# Altium schematic sheet Sheet1.SchDoc
size A4; SheetNumber: 1; SheetTotal: 1
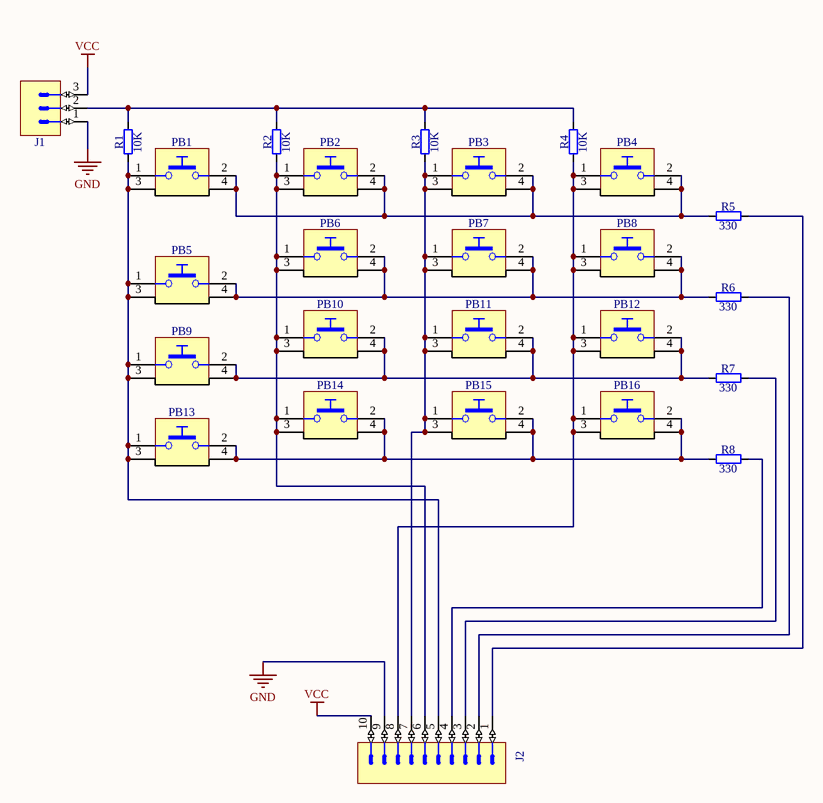
[diagram p0: Sheet1.SchDoc]

## Parts
J1  (no value)  [HARWIN_M22-2010305]
J2  (no value)  [SIP10]
PB1  (no value)  [PB_TYCO_FSM6JSMA]
PB2  (no value)  [PB_TYCO_FSM6JSMA]
PB3  (no value)  [PB_TYCO_FSM6JSMA]
PB4  (no value)  [PB_TYCO_FSM6JSMA]
PB5  (no value)  [PB_TYCO_FSM6JSMA]
PB6  (no value)  [PB_TYCO_FSM6JSMA]
PB7  (no value)  [PB_TYCO_FSM6JSMA]
PB8  (no value)  [PB_TYCO_FSM6JSMA]
PB9  (no value)  [PB_TYCO_FSM6JSMA]
PB10  (no value)  [PB_TYCO_FSM6JSMA]
PB11  (no value)  [PB_TYCO_FSM6JSMA]
PB12  (no value)  [PB_TYCO_FSM6JSMA]
PB13  (no value)  [PB_TYCO_FSM6JSMA]
PB14  (no value)  [PB_TYCO_FSM6JSMA]
PB15  (no value)  [PB_TYCO_FSM6JSMA]
PB16  (no value)  [PB_TYCO_FSM6JSMA]
R1  10K  [RESC2012X60N]
R2  10K  [RESC2012X60N]
R3  10K  [RESC2012X60N]
R4  10K  [RESC2012X60N]
R5  330  [RESC2012X60N]
R6  330  [RESC2012X60N]
R7  330  [RESC2012X60N]
R8  330  [RESC2012X60N]

## Nets
GND: J1.1 J2.9
VCC: J1.3 J2.10
NetJ1_2: J1.2 R1.2 R2.2 R3.2 R4.2
NetJ2_1: J2.1 R5.2
NetJ2_2: J2.2 R6.2
NetJ2_3: J2.3 R7.2
NetJ2_4: J2.4 R8.2
NetJ2_5: J2.5 PB1.1 PB1.3 PB5.1 PB5.3 PB9.1 PB9.3 PB13.1 PB13.3 R1.1
NetJ2_6: J2.6 PB2.1 PB2.3 PB6.1 PB6.3 PB10.1 PB10.3 PB14.1 PB14.3 R2.1
NetJ2_7: J2.7 PB3.1 PB3.3 PB7.1 PB7.3 PB11.1 PB11.3 PB15.1 PB15.3 R3.1
NetJ2_8: J2.8 PB4.1 PB4.3 PB8.1 PB8.3 PB12.1 PB12.3 PB16.1 PB16.3 R4.1
NetPB1_2: PB1.2 PB1.4 PB2.2 PB2.4 PB3.2 PB3.4 PB4.2 PB4.4 R5.1
NetPB5_2: PB5.2 PB5.4 PB6.2 PB6.4 PB7.2 PB7.4 PB8.2 PB8.4 R6.1
NetPB9_2: PB9.2 PB9.4 PB10.2 PB10.4 PB11.2 PB11.4 PB12.2 PB12.4 R7.1
NetPB13_2: PB13.2 PB13.4 PB14.2 PB14.4 PB15.2 PB15.4 PB16.2 PB16.4 R8.1

## Library data of the parts
J1 = Connector 3 Male
J2 = Connector 10 Male
PB1-PB16 = PB SPST 1NO-2NO 34CASE: Push-Button Switch SPDT
R1-R8 = Resistor